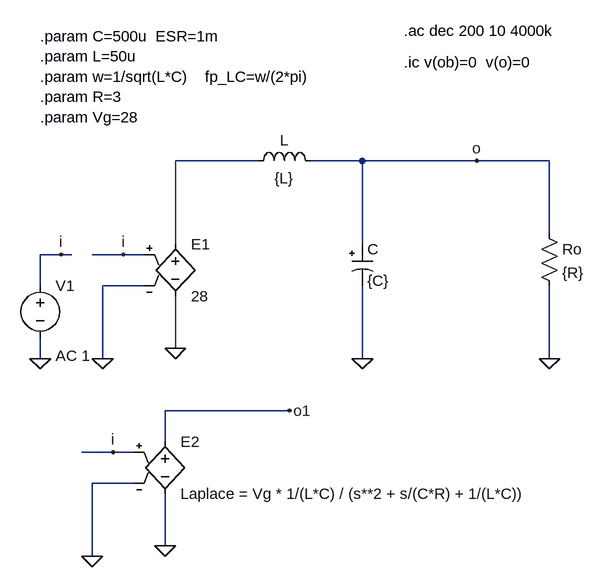
[diagram p0: schematic Control_to_output.asc]
Control_to_output.asc, the LTspice schematic file:
Version 4
SHEET 1 880 804
WIRE -160 176 -288 176
WIRE 0 176 -80 176
WIRE 176 176 0 176
WIRE 288 176 176 176
WIRE 288 288 288 176
WIRE -288 304 -288 176
WIRE 0 304 0 176
WIRE -464 320 -496 320
WIRE -448 320 -464 320
WIRE -368 320 -416 320
WIRE -336 320 -368 320
WIRE -496 368 -496 320
WIRE -336 368 -400 368
WIRE -288 464 -288 384
WIRE -496 480 -496 448
WIRE -400 480 -400 368
WIRE 0 480 0 368
WIRE 288 480 288 368
WIRE -112 560 -304 560
WIRE -304 608 -304 560
WIRE -384 624 -432 624
WIRE -352 624 -384 624
WIRE -352 672 -416 672
WIRE -304 768 -304 688
WIRE -416 784 -416 672
FLAG -288 464 0
FLAG 0 480 0
FLAG 288 480 0
FLAG -400 480 0
FLAG -368 320 i
FLAG 176 176 o
FLAG -496 480 0
FLAG -464 320 i
FLAG -304 768 0
FLAG -416 784 0
FLAG -384 624 i
FLAG -112 560 o1
SYMBOL e -288 288 R0
SYMATTR InstName E1
SYMATTR Value 28
SYMBOL ind -176 192 R270
WINDOW 0 32 56 VTop 2
WINDOW 3 5 56 VBottom 2
SYMATTR InstName L
SYMATTR Value {L}
SYMATTR SpiceLine Ipk=5 Rser=1m Rpar=0 Cpar=0
SYMBOL res 272 272 R0
SYMATTR InstName Ro
SYMATTR Value {R}
SYMBOL polcap -16 304 R0
WINDOW 3 24 56 Left 2
SYMATTR InstName C
SYMATTR Value {C}
SYMATTR Description Capacitor
SYMATTR Type cap
SYMATTR SpiceLine V=50 Irms=1.47 Rser={ESR} Lser=0
SYMBOL voltage -496 352 R0
WINDOW 123 24 124 Left 2
WINDOW 39 0 0 Left 2
SYMATTR InstName V1
SYMATTR Value ""
SYMATTR Value2 AC 1
SYMBOL e -304 592 R0
SYMATTR InstName E2
SYMATTR Value Laplace = Vg * 1/(L*C) / (s**2 + s/(C*R) + 1/(L*C))
TEXT -496 -16 Left 2 !.param C=500u  ESR=1m\n.param L=50u\n.param w=1/sqrt(L*C)    fp_LC=w/(2*pi)\n.param R=3\n.param Vg=28
TEXT 64 24 Left 2 !.ic v(ob)=0  v(o)=0
TEXT 64 -24 Left 2 !.ac dec 200 10 4000k

The netlist it stands for:
* Control_to_output.asc
E1 N001 0 i 0 28
L N001 o {L} Ipk=5 Rser=1m Rpar=0 Cpar=0
Ro o 0 {R}
C o 0 {C} V=50 Irms=1.47 Rser={ESR} Lser=0
V1 i 0 AC 1
E2 o1 0 i 0 Laplace = Vg * 1/(L*C) / (s**2 + s/(C*R) + 1/(L*C))
.param C=500u  ESR=1m
.param L=50u
.param w=1/sqrt(L*C)    fp_LC=w/(2*pi)
.param R=3
.param Vg=28
.ic v(ob)=0  v(o)=0
.ac dec 200 10 4000k
.backanno
.end